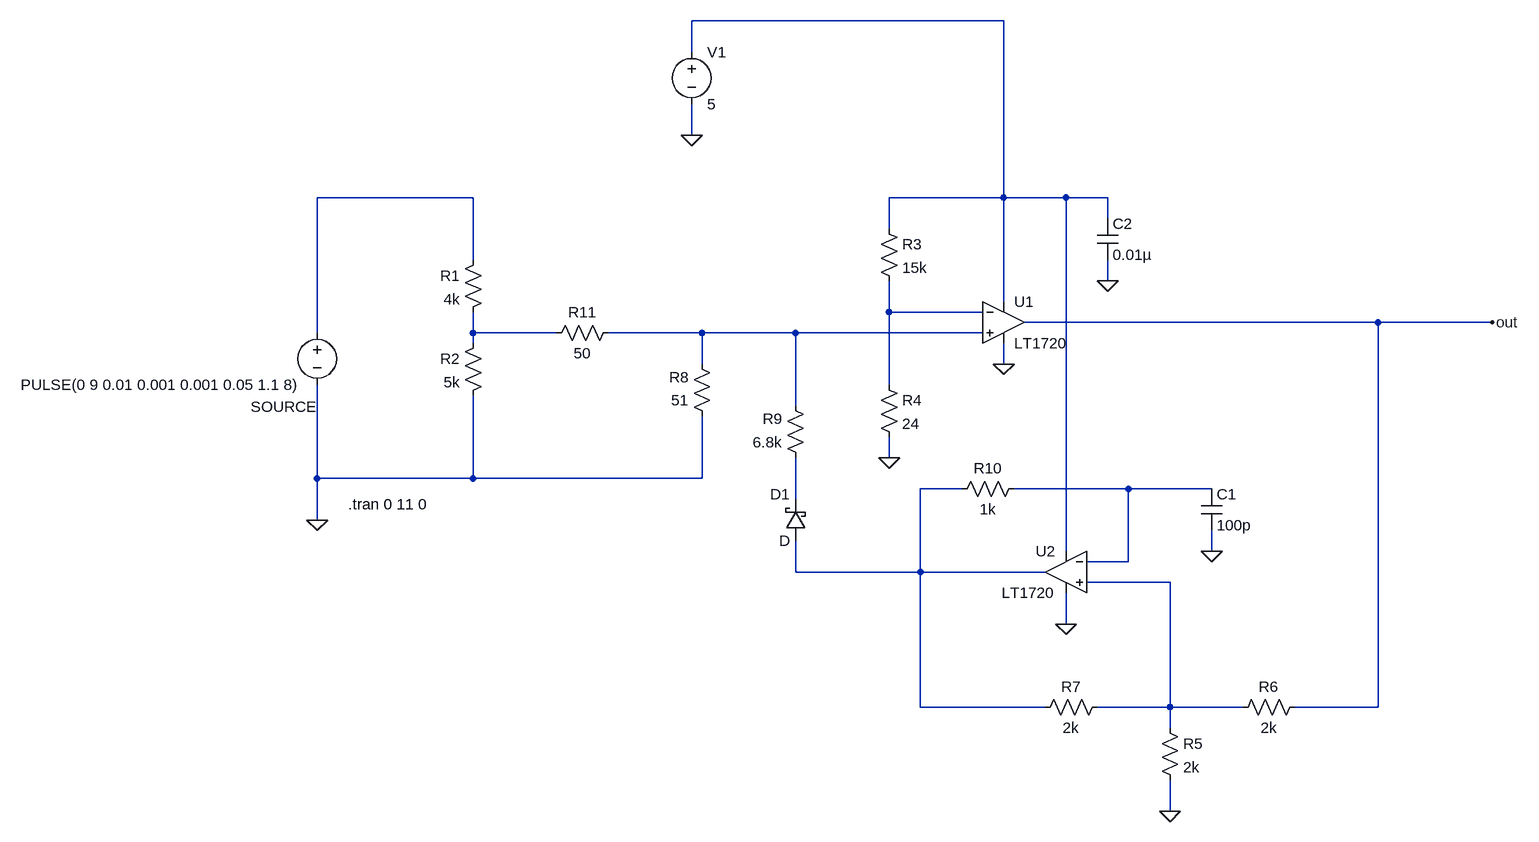
[diagram p0: schematic pulse_source.asc]
pulse_source.asc, the LTspice schematic file:
Version 4
SHEET 1 916 1608
WIRE -704 64 -1184 64
WIRE -1184 112 -1184 64
WIRE -1184 240 -1184 192
WIRE -1520 336 -1760 336
WIRE -704 336 -704 64
WIRE -704 336 -880 336
WIRE -608 336 -704 336
WIRE -544 336 -608 336
WIRE -544 368 -544 336
WIRE -880 384 -880 336
WIRE -1520 432 -1520 336
WIRE -544 464 -544 432
WIRE -704 496 -704 336
WIRE -880 512 -880 464
WIRE -736 512 -880 512
WIRE -128 528 -672 528
WIRE 48 528 -128 528
WIRE -1760 544 -1760 336
WIRE -1520 544 -1520 512
WIRE -1392 544 -1520 544
WIRE -1168 544 -1312 544
WIRE -1024 544 -1168 544
WIRE -736 544 -1024 544
WIRE -1520 560 -1520 544
WIRE -1168 592 -1168 544
WIRE -704 592 -704 560
WIRE -880 624 -880 512
WIRE -1024 656 -1024 544
WIRE -880 736 -880 704
WIRE -1760 768 -1760 624
WIRE -1520 768 -1520 640
WIRE -1520 768 -1760 768
WIRE -1168 768 -1168 672
WIRE -1168 768 -1520 768
WIRE -768 784 -832 784
WIRE -512 784 -688 784
WIRE -384 784 -512 784
WIRE -1024 800 -1024 736
WIRE -1760 832 -1760 768
WIRE -608 880 -608 336
WIRE -384 880 -384 848
WIRE -512 896 -512 784
WIRE -512 896 -576 896
WIRE -1024 912 -1024 864
WIRE -832 912 -832 784
WIRE -832 912 -1024 912
WIRE -640 912 -832 912
WIRE -448 928 -576 928
WIRE -608 992 -608 944
WIRE -832 1120 -832 912
WIRE -640 1120 -832 1120
WIRE -448 1120 -448 928
WIRE -448 1120 -560 1120
WIRE -336 1120 -448 1120
WIRE -128 1120 -128 528
WIRE -128 1120 -256 1120
WIRE -448 1152 -448 1120
WIRE -448 1280 -448 1232
FLAG -1760 832 0
FLAG -544 464 0
FLAG -880 736 0
FLAG -704 592 0
FLAG -384 880 0
FLAG -448 1280 0
FLAG -608 992 0
FLAG -1184 240 0
FLAG 48 528 out
SYMBOL voltage -1760 528 M0
WINDOW 123 0 0 Left 0
WINDOW 39 24 132 Left 0
WINDOW 0 0 130 Left 0
SYMATTR InstName SOURCE
SYMATTR Value PULSE(0 9 0.01 0.001 0.001 0.05 1.1 8)
SYMBOL res -1504 544 M0
SYMATTR InstName R2
SYMATTR Value 5k
SYMBOL res -1504 416 M0
SYMATTR InstName R1
SYMATTR Value 4k
SYMBOL Comparators\\LT1720 -704 464 R0
SYMATTR InstName U1
SYMBOL Comparators\\LT1720 -608 848 M0
SYMATTR InstName U2
SYMBOL res -896 368 R0
SYMATTR InstName R3
SYMATTR Value 15k
SYMBOL res -896 608 R0
SYMATTR InstName R4
SYMATTR Value 24
SYMBOL res -464 1136 R0
SYMATTR InstName R5
SYMATTR Value 2k
SYMBOL res -240 1104 R90
WINDOW 0 0 56 VBottom 0
WINDOW 3 32 56 VTop 0
SYMATTR InstName R6
SYMATTR Value 2k
SYMBOL res -544 1104 R90
WINDOW 0 0 56 VBottom 0
WINDOW 3 32 56 VTop 0
SYMATTR InstName R7
SYMATTR Value 2k
SYMBOL res -1152 688 R180
WINDOW 0 36 76 Left 0
WINDOW 3 36 40 Left 0
SYMATTR InstName R8
SYMATTR Value 51
SYMBOL res -1008 752 R180
WINDOW 0 36 76 Left 0
WINDOW 3 36 40 Left 0
SYMATTR InstName R9
SYMATTR Value 6.8k
SYMBOL res -672 768 R90
WINDOW 0 0 56 VBottom 0
WINDOW 3 32 56 VTop 0
SYMATTR InstName R10
SYMATTR Value 1k
SYMBOL cap -400 784 R0
SYMATTR InstName C1
SYMATTR Value 100p
SYMBOL cap -560 368 R0
SYMATTR InstName C2
SYMATTR Value 0.01µ
SYMBOL schottky -1008 864 R180
WINDOW 0 24 72 Left 0
WINDOW 3 24 0 Left 0
SYMATTR InstName D1
SYMBOL res -1296 528 R90
WINDOW 0 0 56 VBottom 0
WINDOW 3 32 56 VTop 0
SYMATTR InstName R11
SYMATTR Value 50
SYMBOL voltage -1184 96 R0
SYMATTR InstName V1
SYMATTR Value 5
TEXT -1712 808 Left 0 !.tran 0 11 0

The netlist it stands for:
* pulse_source.asc
V§SOURCE N002 0 PULSE(0 9 0.01 0.001 0.001 0.05 1.1 8)
R2 N004 0 5k
R1 N002 N004 4k
XU1 N005 N003 N001 0 out LT1720  ; pins In+ In- V+ V- OUT
XU2 N009 N007 N001 0 N006 LT1720  ; pins In+ In- V+ V- OUT
R3 N001 N003 15k
R4 N003 0 24
R5 N009 0 2k
R6 out N009 2k
R7 N009 N006 2k
R8 0 N005 51
R9 N008 N005 6.8k
R10 N007 N006 1k
C1 N007 0 100p
C2 N001 0 0.01µ
D1 N006 N008 D
R11 N005 N004 50
V1 N001 0 5
.model D D
.lib standard.dio
.tran 0 11 0
.lib LT1720.sub
.backanno
.end